# EAGLE design Lora Shield v1.4 (EAGLE 9.3.1)
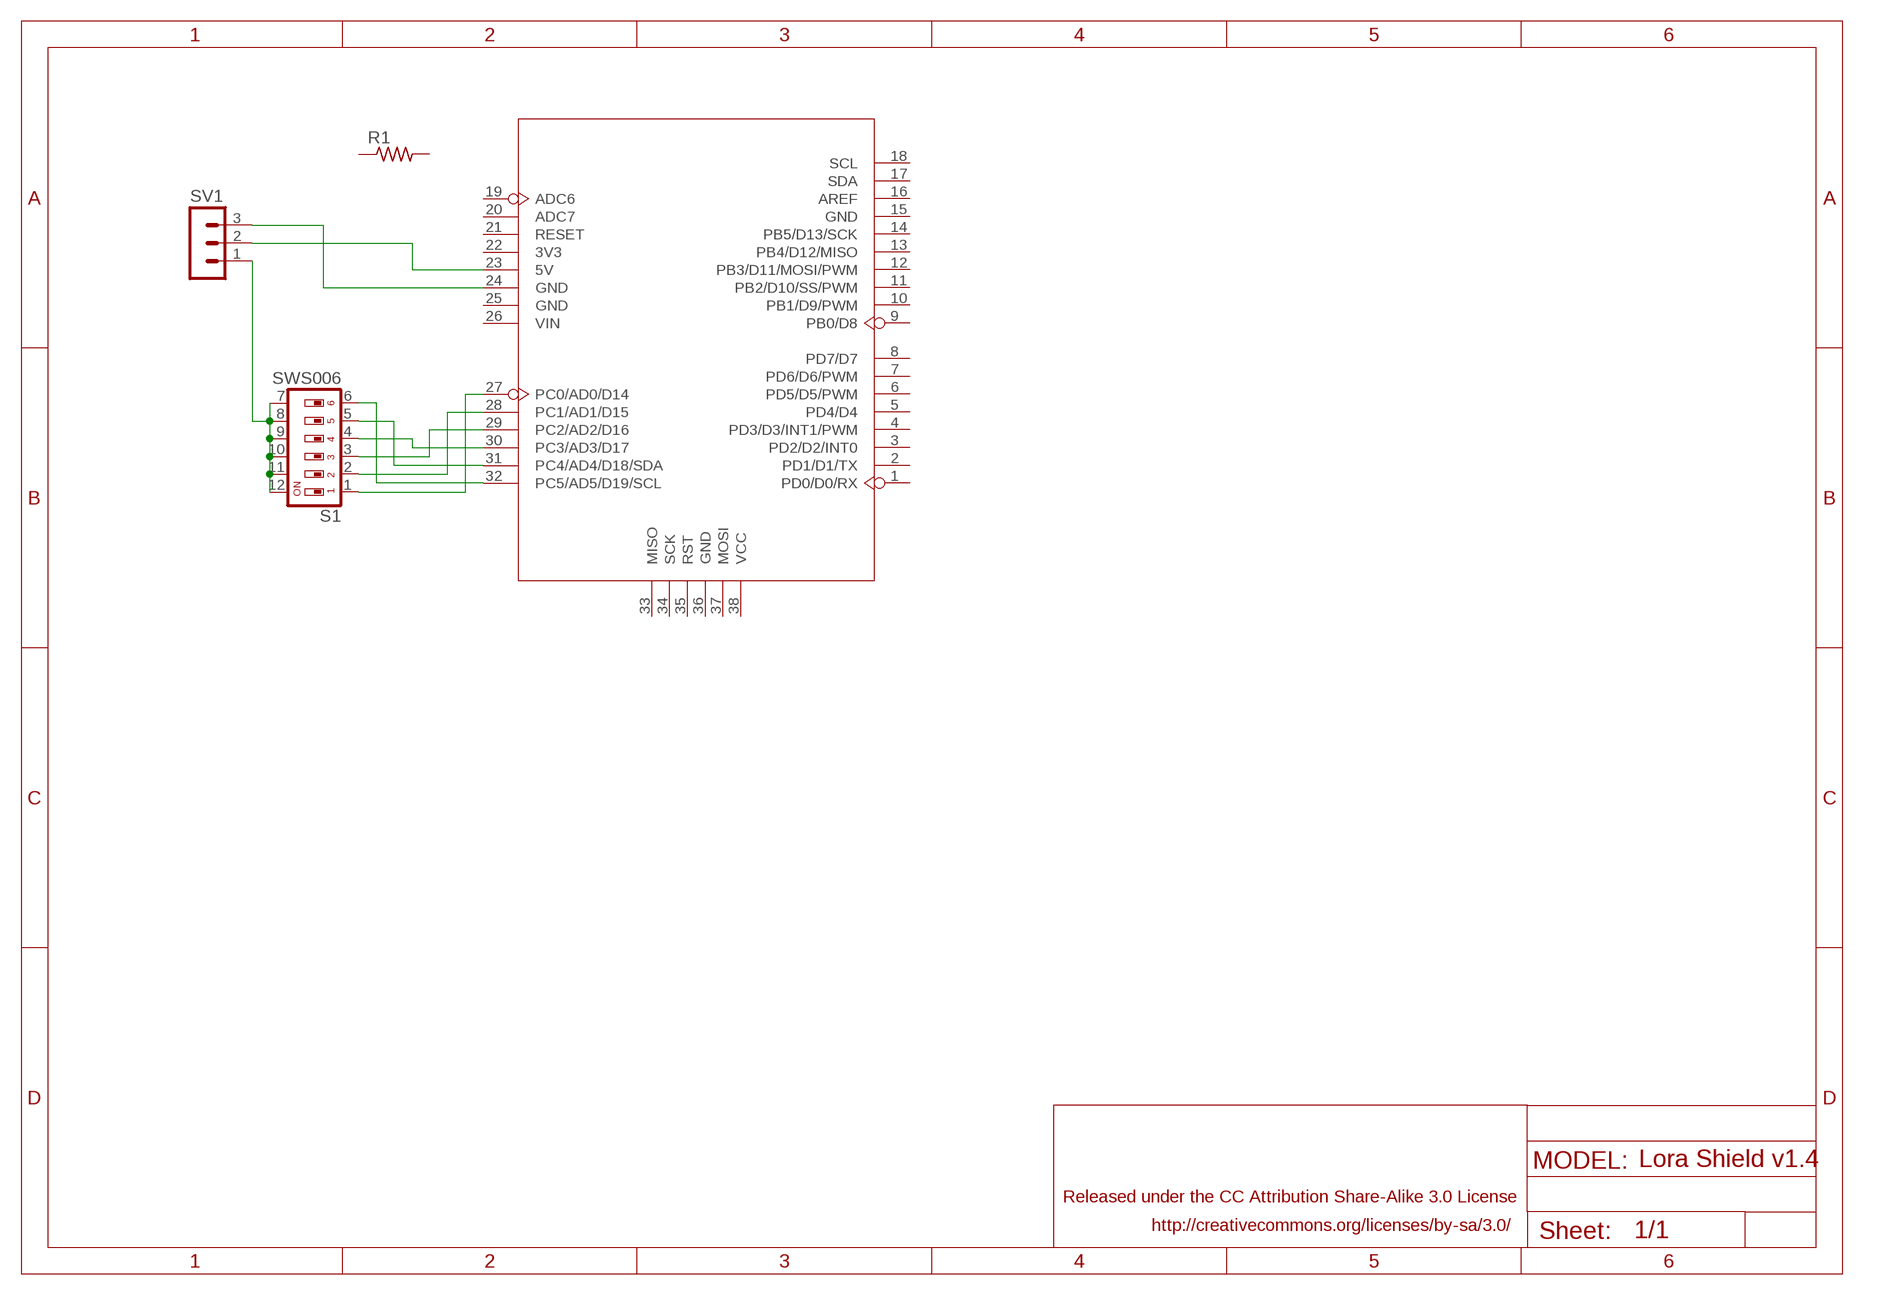
[diagram p0: schematic, sheet 1]

## Parts
R1  R-US_R0805  [R0805]
S1  SWS006  [SMS-006]
SV1  MA03-1  [MA03-1]
U5  MOUDLE_ARDUINO-38P328P_NO_VIA  [MOUDLE_ARDUINO-328P--]

## Nets
DATA: S1.7 S1.8 S1.9 S1.10 S1.11 S1.12 SV1.1
N$1: S1.1 U5.27(PC0/AD0/D14)
N$2: S1.2 U5.28(PC1/AD1/D15)
N$3: S1.3 U5.29(PC2/AD2/D16)
N$4: S1.4 U5.30(PC3/AD3/D17)
N$5: S1.5 U5.31(PC4/AD4/D18/SDA)
N$6: S1.6 U5.32(PC5/AD5/D19/SCL)
N$7: SV1.3 U5.24(GND)
N$8: SV1.2 U5.23(5V)
Unconnected: R1.1 R1.2 U5.1(PD0/D0/RX) U5.2(PD1/D1/TX) U5.3(PD2/D2/INT0) U5.4(PD3/D3/INT1/PWM) U5.5(PD4/D4) U5.6(PD5/D5/PWM) U5.7(PD6/D6/PWM) U5.8(PD7/D7) U5.9(PB0/D8) U5.10(PB1/D9/PWM) U5.11(PB2/D10/SS/PWM) U5.12(PB3/D11/MOSI/PWM) U5.13(PB4/D12/MISO) U5.14(PB5/D13/SCK) U5.15(GND) U5.16(AREF) U5.17(SDA) U5.18(SCL) U5.19(ADC6) U5.20(ADC7) U5.21(RESET) U5.22(3V3) U5.25(GND) U5.26(VIN) U5.33(MISO) U5.34(SCK) U5.35(RST) U5.36(GND) U5.37(MOSI) U5.38(VCC)

## Library data of the parts
R1 = rcl:R-US_: RESISTOR, American symbol; SPICEPREFIX: R
S1 = smd-special:SWS006: SMD Dip Switch 6 pol.
SV1 = con-lstb:MA03-1: PIN HEADER; OC_FARNELL: unknown; OC_NEWARK: unknown
U5 = board_arduino:MOUDLE_ARDUINO-38P

## Net classes
0 default: clearance 0.205 mm
2 gnd: width 0.305 mm, drill 0.305 mm, clearance 0.254 mm

## Board
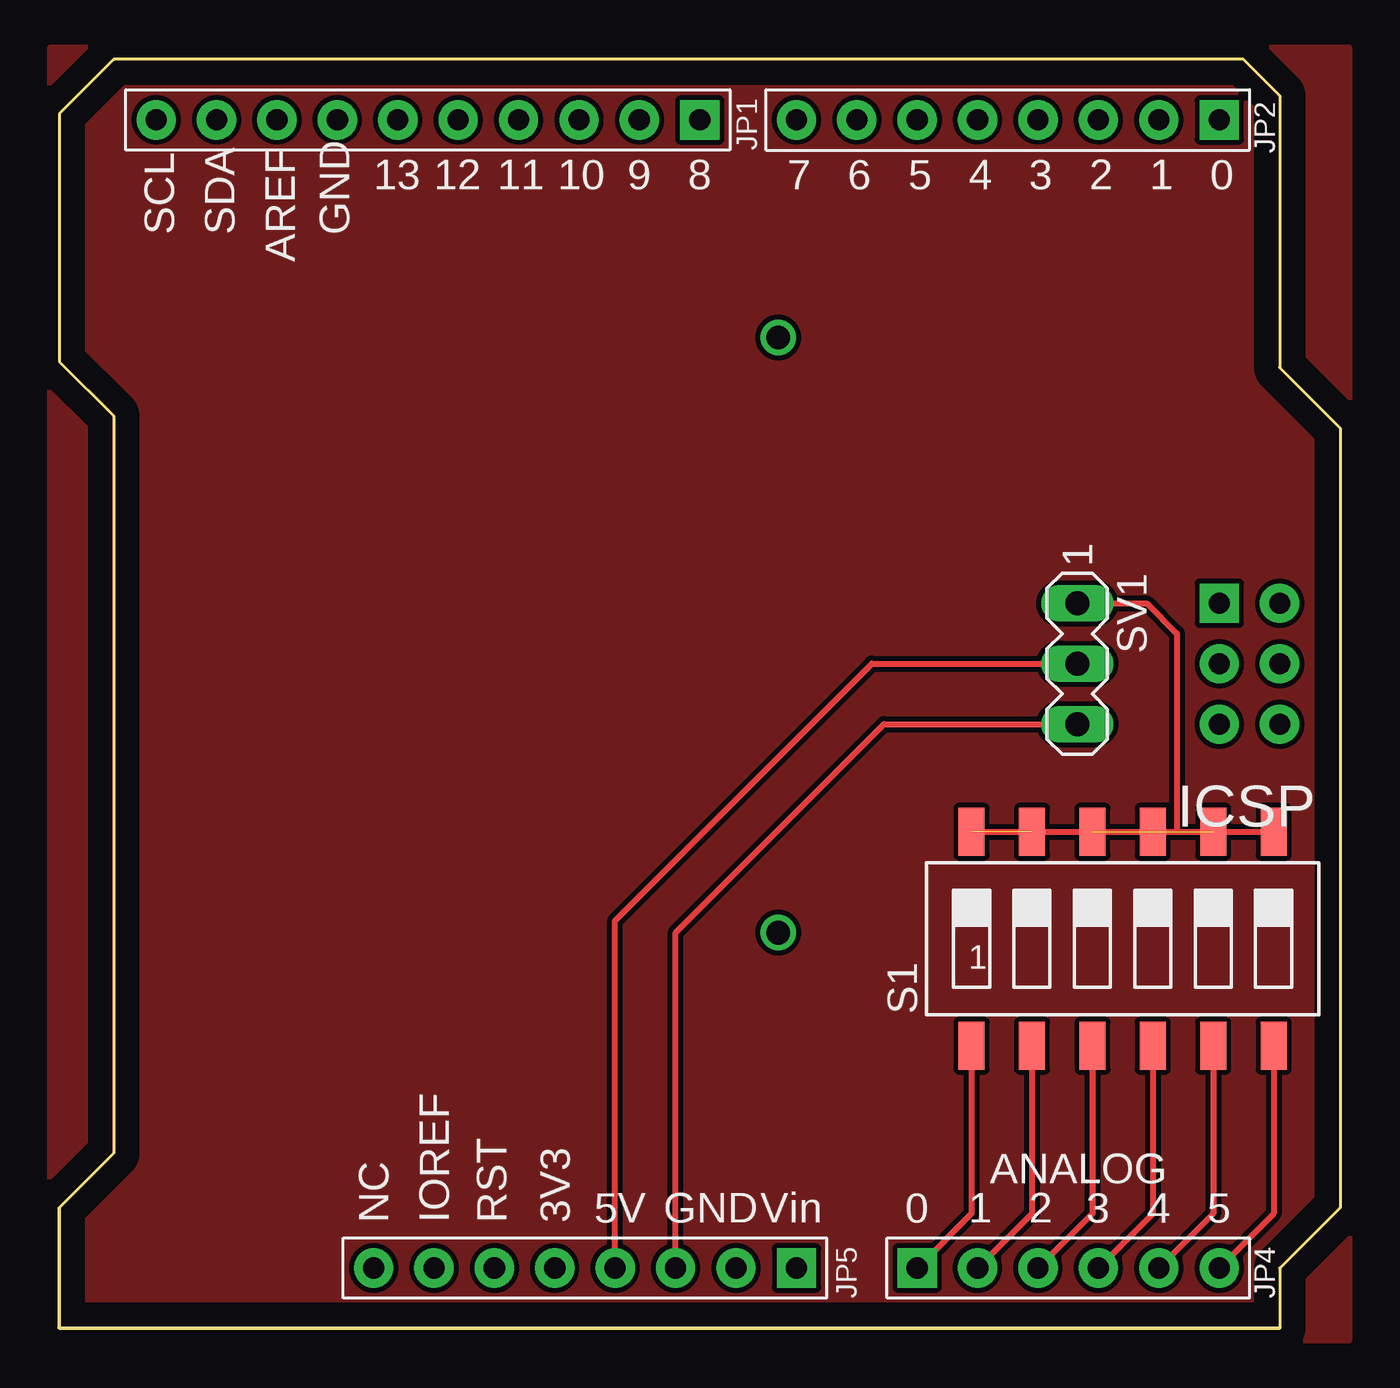
[diagram p1: board, top side]
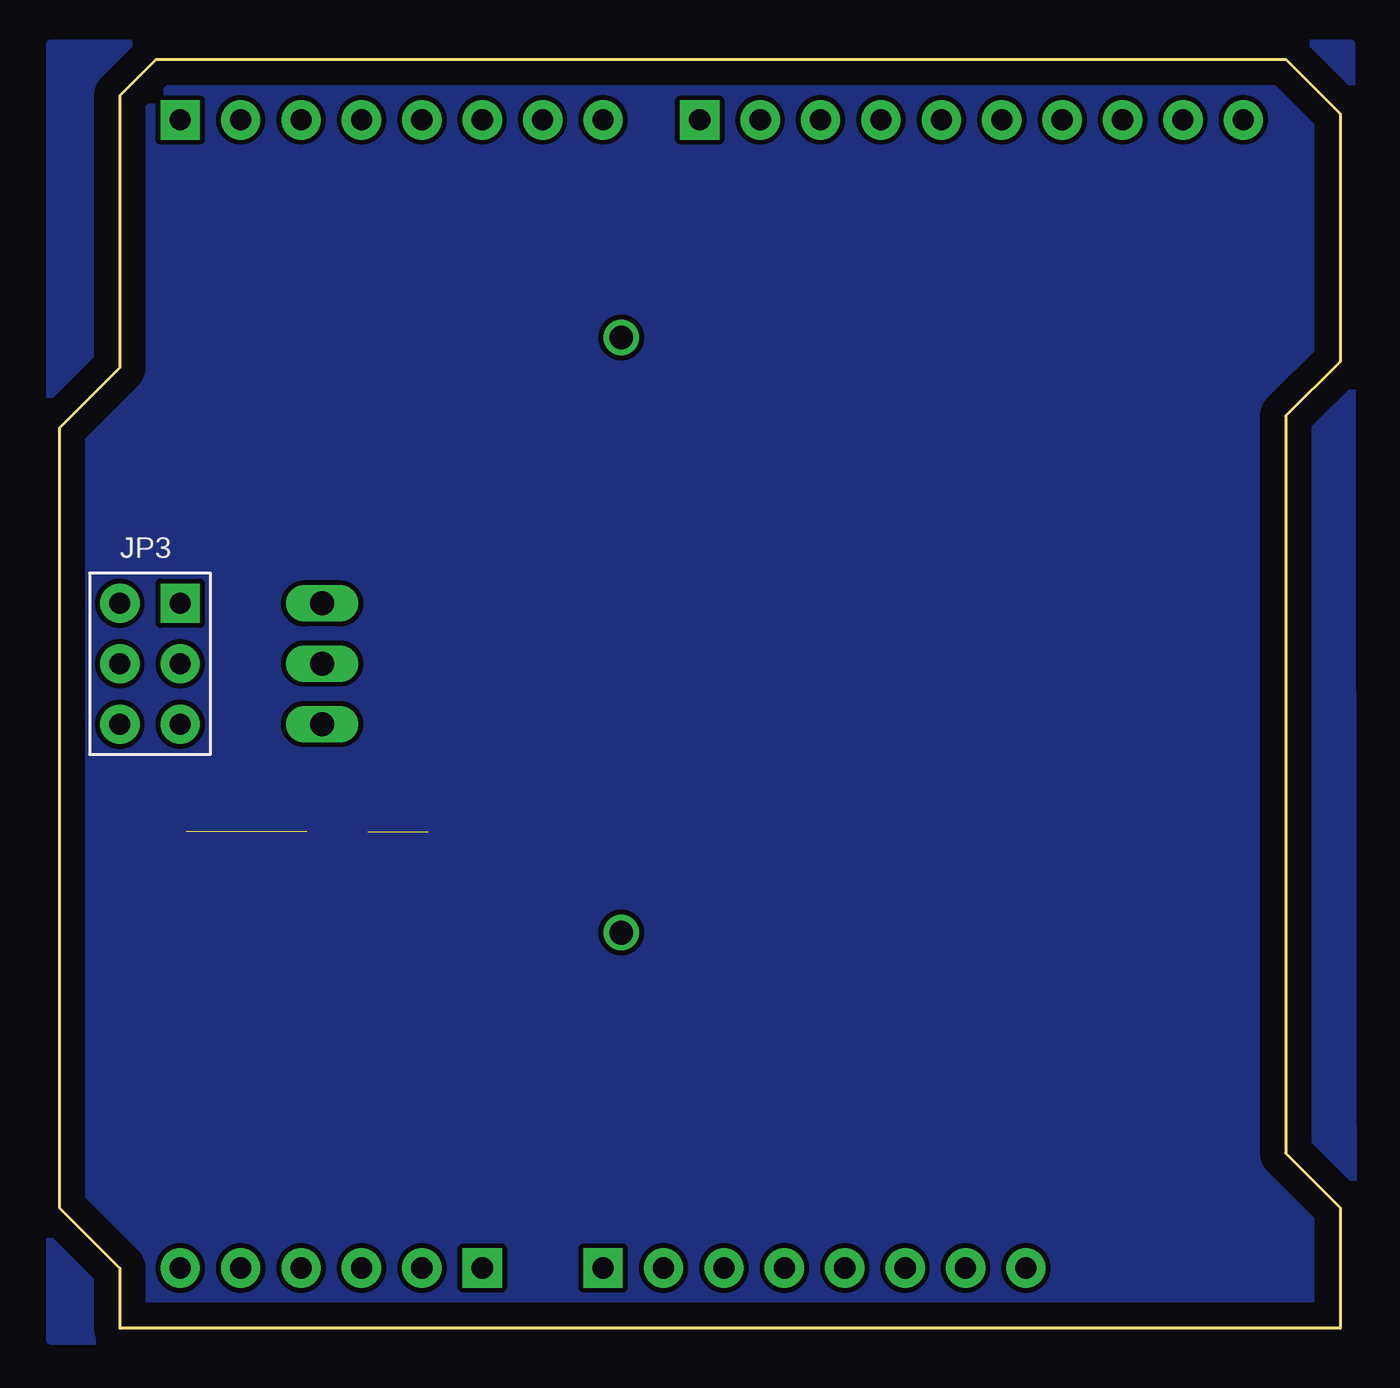
[diagram p2: board, bottom side, seen from below]

Size 53.85 x 53.34 mm. Coordinates in mm from the lower left corner, seen from the top.
Copper layers (1*16): Top 0.035mm / dielectric 1.5mm / Bottom 0.035mm
Design rules "Lora Shield v1.4": minimum track width 10mil, minimum drill 10mil, track to track 0.205mm, track to pad 0.205mm, pad to pad 0.205mm, via to via 0.205mm, smd to smd 8mil, copper to edge 40mil, drill to drill 8mil, minimum pad ring 10mil, minimum via ring 8mil, stop-mask expansion 4mil, vias tented up to drill 30mil, thermal gap 10mil
bRestrict: area -30.2,14 to -16.1,16.3

### Footprints (pad centres in the part's own frame; a part is rotated, then mirrored left to right if it is on the bottom)
R0805 = smd 1.3 x 1.5: 1 -0.95,0; 2 0.95,0
SMS-006 = smd 1.092 x 2.007: 1 -6.35,-4.496; 2 -3.81,-4.496; 3 -1.27,-4.496; 4 1.27,-4.496; 5 3.81,-4.496; 6 6.35,-4.496; 7 6.35,4.496; 8 3.81,4.496; 9 1.27,4.496; 10 -1.27,4.496; 11 -3.81,4.496; 12 -6.35,4.496
MA03-1 = drill 1.016 long: 1 -2.54,0; 2 0,0; 3 2.54,0
MOUDLE_ARDUINO-328P-- = drill 0.889 pad 1.651 square: 1 27.94,24.13; 9 6.096,24.13; 26 10.16,-24.13; 27 15.24,-24.13; 33 27.94,3.81 | drill 0.889 pad 1.651: 2 25.4,24.13; 3 22.86,24.13; 4 20.32,24.13; 5 17.78,24.13; 6 15.24,24.13; 7 12.7,24.13; 8 10.16,24.13; 10 3.556,24.13; 11 1.016,24.13; 12 -1.524,24.13; 13 -4.064,24.13; 14 -6.604,24.13; 15 -9.144,24.13; 16 -11.684,24.13; 17 -14.224,24.13; 18 -16.764,24.13; 19 -7.62,-24.13; 20 -5.08,-24.13; 21 -2.54,-24.13; 22 0,-24.13; 23 2.54,-24.13; 24 5.08,-24.13; 25 7.62,-24.13; 28 17.78,-24.13; 29 20.32,-24.13; 30 22.86,-24.13; 31 25.4,-24.13; 32 27.94,-24.13; 34 27.94,1.27; 35 27.94,-1.27; 36 30.48,-1.27; 37 30.48,1.27; 38 30.48,3.81

### Placement (x,y rotation side)
R1  -51.56,-3.81 0 top  (outside the outline)
S1  44.7,16.38 0 top
SV1  42.8,27.94 270 top
U5  20.83,26.67 0 top

### Tracks (layer width: path | path; a pad name or v marks a point on that pad's centre or on a via)
DATA  (4 unrouted)
  Top 0.254: S1.12 46.99,20.88 | 46.99,20.88 S1.7 | SV1.1 45.72,30.48 46.99,29.21 46.99,20.88
GND
  pour Top: -0.38,53.85 54.23,53.85 54.23,-0.51 -0.38,-0.51
  pour Bottom: -0.45,53.98 -0.51,-0.5 54.21,-0.5 54.21,53.98
N$1
  Top 0.254: S1.1 38.35,4.83 U5.27
N$2
  Top 0.254: S1.2 40.89,4.83 U5.28
N$3
  Top 0.254: S1.3 43.43,4.83 U5.29
N$4
  Top 0.254: S1.4 45.97,4.83 U5.30
N$5
  Top 0.254: S1.5 48.51,4.83 U5.31
N$6
  Top 0.254: S1.6 51.05,4.83 U5.32
N$7
  Top 0.254: U5.24 25.91,16.64 34.67,25.4 SV1.3
N$8
  Top 0.254: U5.23 23.37,17.15 34.16,27.94 SV1.2
N$9  (via drill 1 pad 1.3)
  other vias: 30.23,16.64
N$10  (via drill 1 pad 1.3)
  other vias: 30.23,41.66

### Text on the board
tPlace: ICSP
bDocu: 433MHZ | 868MHZ | 915MHZ